# EAGLE design pain (EAGLE 9.6.2)
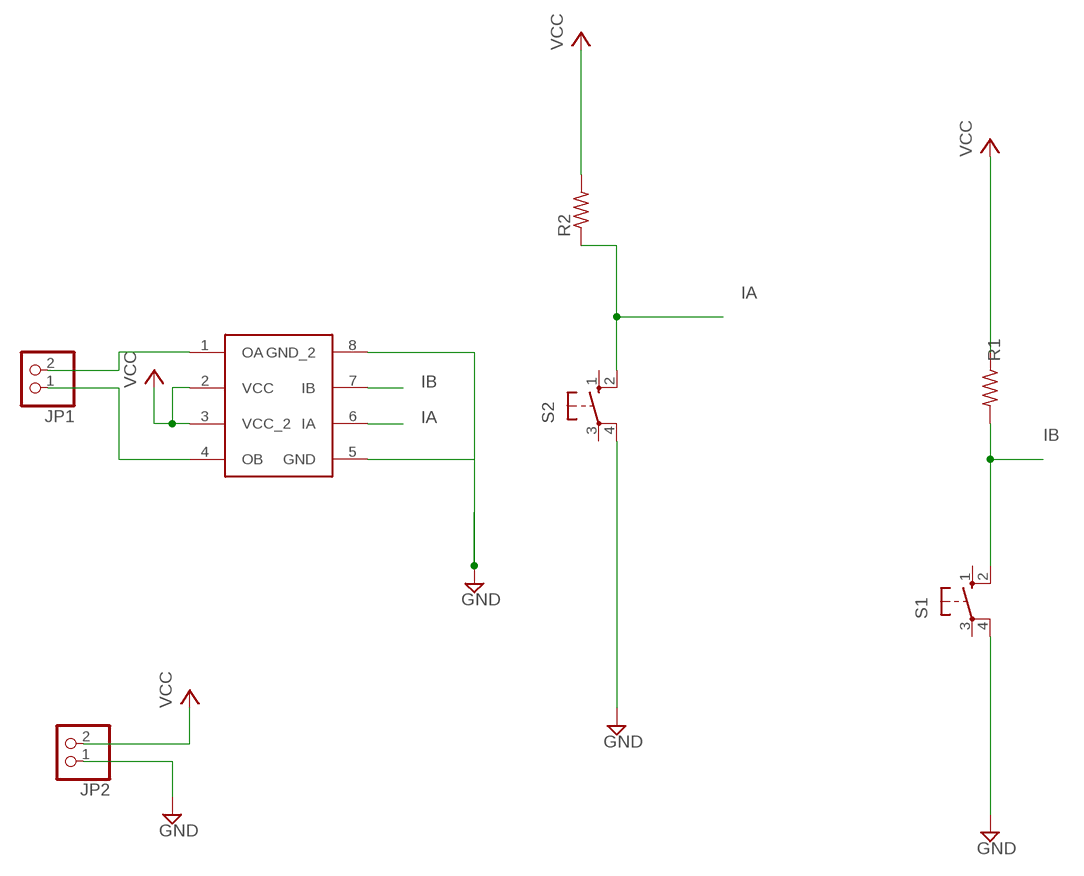
[diagram p0: schematic, sheet 1]

## Parts
JP1  PINHD-1X2  [1X02]
JP2  PINHD-1X2  [1X02]
R1  R-US_R0603  [R0603]
R2  R-US_R0603  [R0603]
S1  40-XX  [B3F-40XX]
S2  40-XX  [B3F-40XX]
U$1  L9110  [DIP8]

## Nets
GND: JP2.1 S1.4(P1) S2.4(P1) U$1.5(GND) U$1.8(GND_2)
IA: R2.1 S2.2(S1) U$1.6(IA)
IB: R1.2 S1.2(S1) U$1.7(IB)
N$1: JP1.1 U$1.4(OB)
N$2: JP1.2 U$1.1(OA)
VCC: JP2.2 R1.1 R2.2 U$1.2(VCC) U$1.3(VCC_2)
Unconnected: S1.1(S) S1.3(P) S2.1(S) S2.3(P)

## Library data of the parts
JP1 JP2 = pinhead:PINHD-1X2: PIN HEADER
R1 R2 = rcl:R-US_: RESISTOR, American symbol; SPICEPREFIX: R
S1 S2 = switch-omron:40-XX: OMRON SWITCH; MF: OMRON COMPONENTS USA; MPN: B3F-4000; OC_FARNELL: 176434; OC_NEWARK: 36K3105
U$1 = BarbieLabLib:L9110

## Board
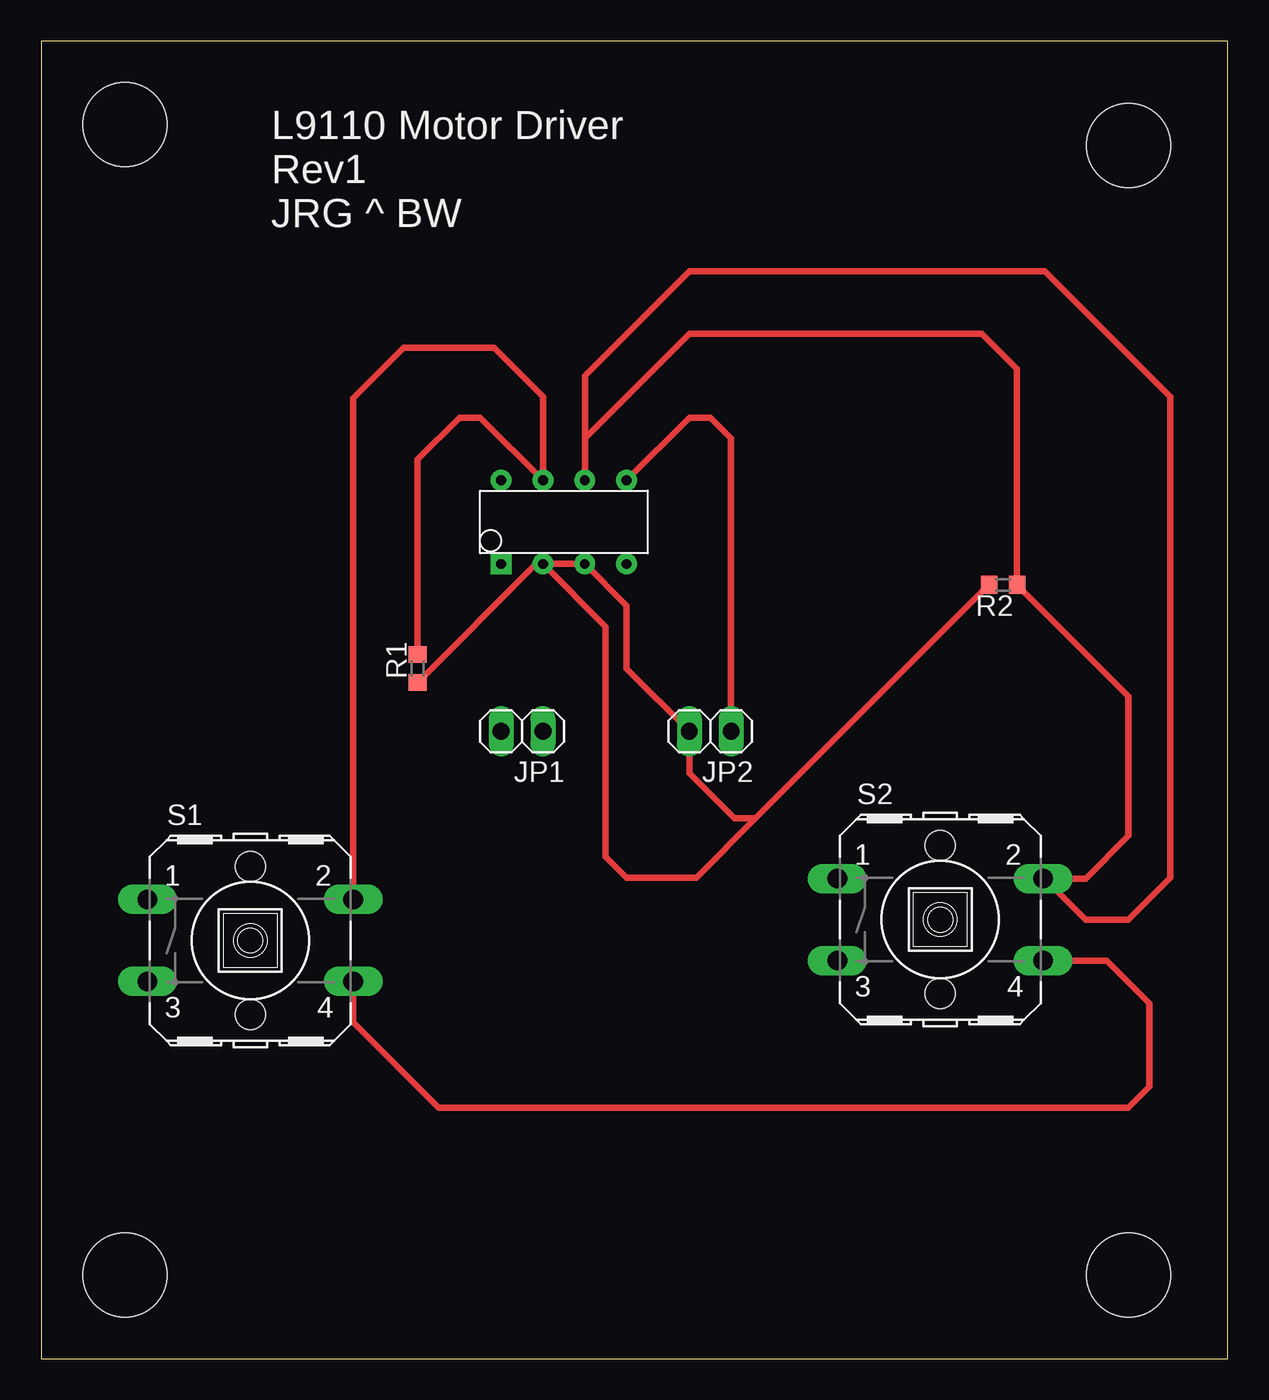
[diagram p1: board, top side]
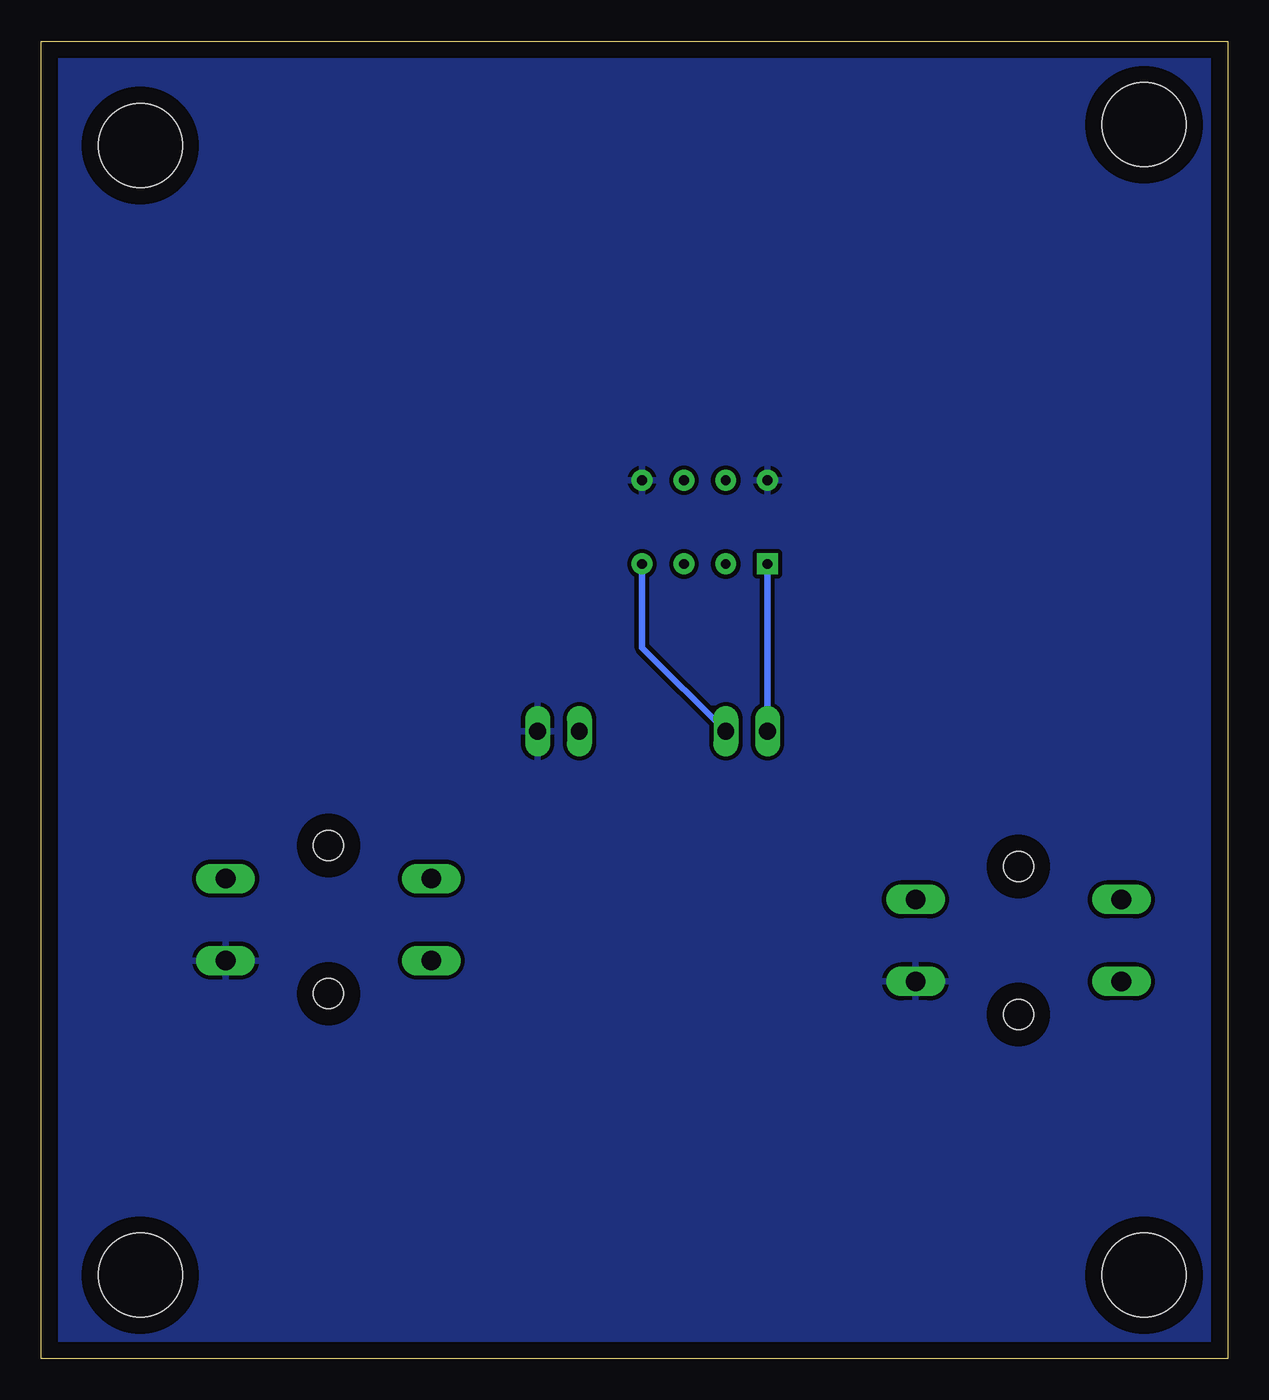
[diagram p2: board, bottom side, seen from below]

Size 72.06 x 80 mm. Coordinates in mm from the lower left corner, seen from the top.
Outline: 0,0 72.06,0 72.06,80 0,80 0,0
Copper layers (1*16): Top 0.035mm / dielectric 1.5mm / Bottom 0.035mm
Design rules "default *": minimum track width 10mil, minimum drill 0.35mm, track to track 10mil, track to pad 6mil, pad to pad 6mil, via to via 6mil, smd to smd 6mil, copper to edge 40mil, drill to drill 6mil, minimum pad ring 10mil, minimum via ring 8mil, stop-mask expansion 4mil, vias tented up to drill 0mil, thermal gap 10mil
Holes 5.09 mm at 5.08,74.93 66.04,73.66 66.04,5.08 5.08,5.08

### Footprints (pad centres in the part's own frame; a part is rotated, then mirrored left to right if it is on the bottom)
1X02 = drill 1.016 long: 1 -1.27,0; 2 1.27,0
R0603 = smd 1 x 1.1: 1 -0.85,0; 2 0.85,0
B3F-40XX = drill 1.194 long: 1 -6.248,2.489; 2 6.248,2.489; 3 -6.248,-2.489; 4 6.248,-2.489 | hole 1.803: 0,-4.496; 0,4.496
DIP8 = drill 0.6 pad 1.27 square: 1 0,0 | drill 0.6 pad 1.27: 2 2.54,0; 3 5.08,0; 4 7.62,0; 5 7.62,5.08; 6 5.08,5.08; 7 2.54,5.08; 8 0,5.08

### Placement (x,y rotation side)
JP1  29.21,38.1 180 top
JP2  40.64,38.1 180 top
R1  22.86,41.91 90 top
R2  58.42,46.99 180 top
S1  12.7,25.4 0 top
S2  54.61,26.67 0 top
U$1  27.94,48.26 0 top

### Tracks (layer width: path | path; a pad name or v marks a point on that pad's centre or on a via)
GND
  Top 0.406: S2.4 64.72,24.18 67.31,21.59 67.31,16.51 66.04,15.24 24.13,15.24 18.95,20.42 S1.4 | JP2.1 41.91,55.88 40.64,57.15 39.37,57.15 U$1.5
  pour Bottom: -6.35,88.9 83.82,88.9 88.9,83.82 88.9,-2.54 80.01,-11.43 -7.62,-11.43 -16.51,-2.54 -16.51,78.74
IA
  Top 0.406: 60.96,29.16 63.45,29.16 66.04,31.75 66.04,40.22 R2.1 59.27,60.11 57.15,62.23 39.37,62.23 33.02,55.88 U$1.6 33.02,59.69 39.37,66.04 60.96,66.04 68.58,58.42 68.58,29.21 66.04,26.67 63.45,26.67 60.96,29.16 | 60.96,29.16 S2.2
IB
  Top 0.406: S1.2 18.95,58.32 22.02,61.38 27.52,61.38 30.48,58.42 U$1.7 26.67,57.15 25.4,57.15 22.86,54.61 R1.2
N$1
  Bottom 0.406: JP1.1 35.56,43.18 U$1.4
N$2
  Bottom 0.406: JP1.2 U$1.1
VCC
  Top 0.406: R2.2 43.39,32.81 | 43.39,32.81 39.79,29.21 35.56,29.21 34.29,30.48 34.29,44.45 U$1.2 | R1.1 30.06,48.26 U$1.2 | U$1.2 U$1.3 35.56,45.72 35.56,41.91 JP2.2 39.37,35.56 42.12,32.81 43.39,32.81

### Text on the board
tPlace: L9110 Motor Driver / Rev1 / JRG ^ BW